# Altium schematic sheet Power.SchDoc
size A; SheetNumber: 1; SheetTotal: 7
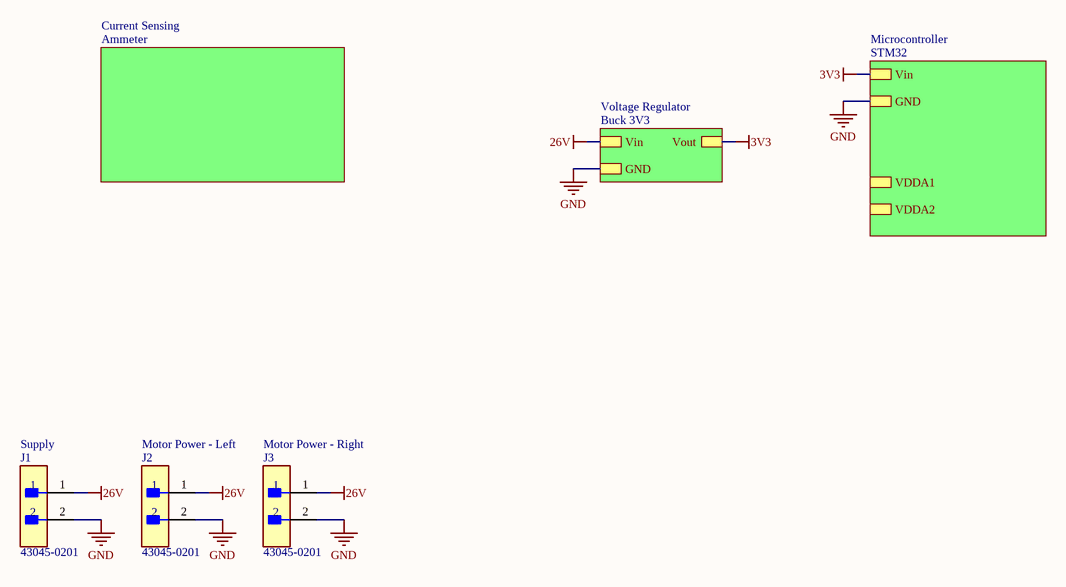
[diagram p0: Power.SchDoc]

## Parts
J1  43045-0201  [FP-43045-0201-MFG]
J2  43045-0201  [FP-43045-0201-MFG]
J3  43045-0201  [FP-43045-0201-MFG]

## Sub-sheets
Current Sensing = Ammeter: no entries
Microcontroller = STM32: Vin, GND, VDDA1, VDDA2
Voltage Regulator = Buck 3V3: Vin, GND, Vout

## Nets
3V3: sheet Microcontroller/Vin, sheet Voltage Regulator/Vout
26V: J1.1 J2.1 J3.1 ; sheet Voltage Regulator/Vin
GND: J1.2 J2.2 J3.2 ; sheet Microcontroller/GND, sheet Voltage Regulator/GND

## Notes on the sheet
- (near J1) Supply
- Motor Power - Left
- (near J3) Motor Power - Right

## Library data of the parts
J1-J3 = CMP-04776-000998-1: CONN HEADER R/A 2POS; Number of Circuits: 2; Glow Wire Compliant: Compliant; Pitch: 3mm; Max Voltage Rating (DC): 250.25kV; Current Rating: 5A; Contact Resistance: 10mR; Gender: Male; Voltage Rating: 250V; Number of Positions: 2; Halogen Free: Low Halogen; Series: 43045; Mount: Through Hole; Packaging: Tray; Row Spacing: 3mm; Contact Material: Brass; Radiation Hardening: No; Number of Contacts: 2; Orientation: Right Angle; Max Operating Temperature: 105°C; Housing Material: Thermoplastic; Contact Plating: Gold; Case/Package: 0201; Number of Rows: 2; Min Operating Temperature: -40°C; Termination: Solder; Package Quantity: 3168